# EAGLE design Analog_Temp_Ctrl (EAGLE 8.5.2)

## Sheet 1 of 2
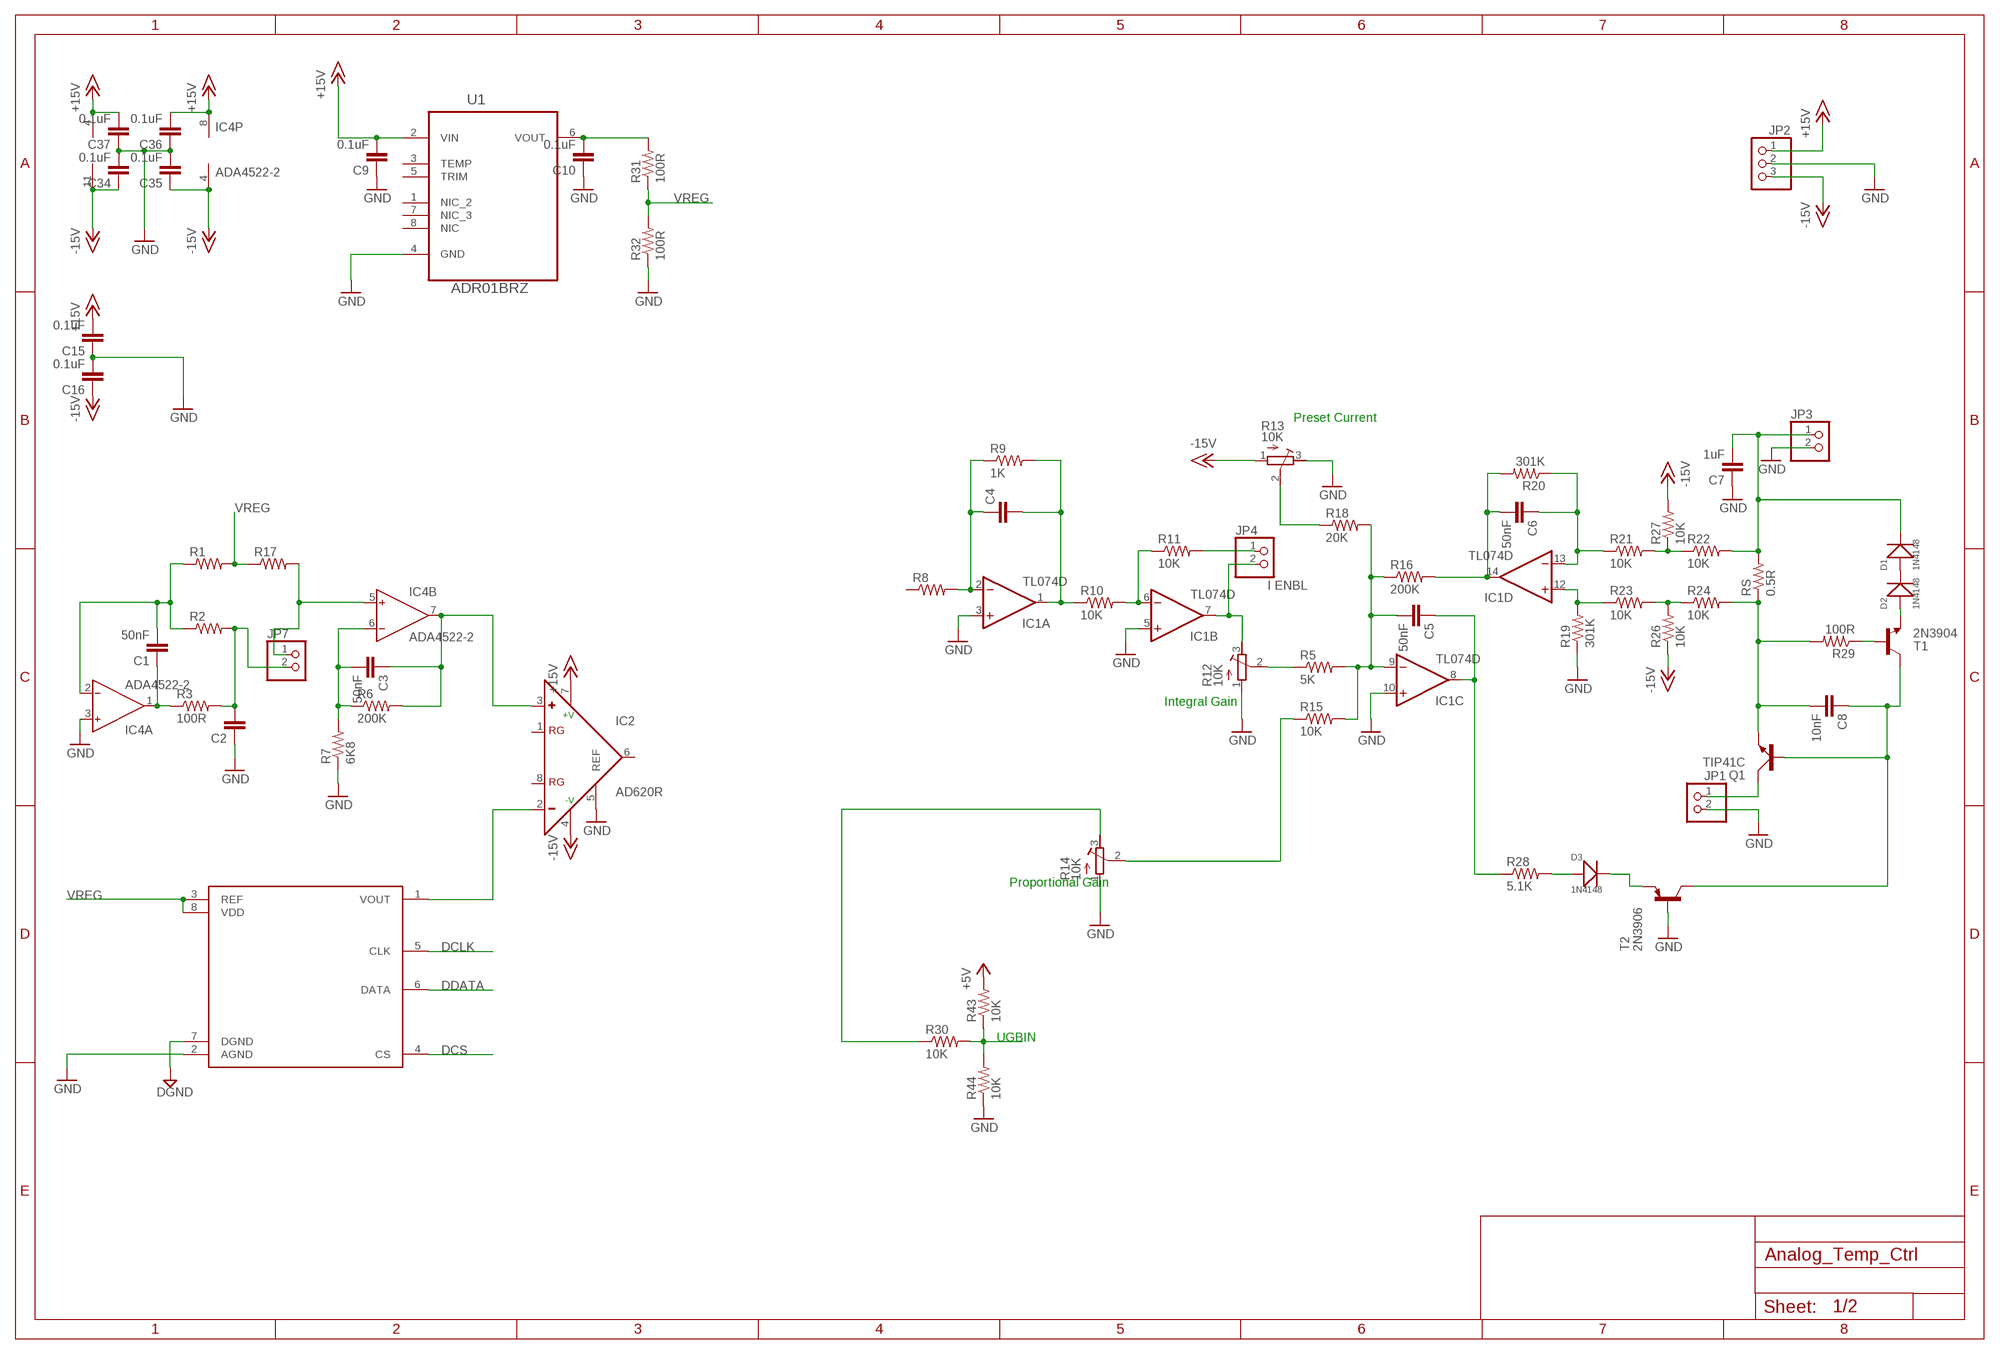
[diagram p0: schematic, sheet 1]

### Parts
C1  50nF  C-EUC0805  [C0805]
C2  C-EUC0805  [C0805]
C3  50nF  C-EUC0805  [C0805]
C4  C-EUC0805  [C0805]
C5  50nF  C-EUC0805  [C0805]
C6  50nF  C-EUC0805  [C0805]
C7  1uF  C-EUC0805  [C0805]
C8  10nF  C-EUC0805  [C0805]
C9  0.1uF  C-EUC0805  [C0805]
C10  0.1uF  C-EUC0805  [C0805]
C15  0.1uF  C-EUC0805  [C0805]
C16  0.1uF  C-EUC0805  [C0805]
C34  0.1uF  C-EUC0805  [C0805]
C35  0.1uF  C-EUC0805  [C0805]
C36  0.1uF  C-EUC0805  [C0805]
C37  0.1uF  C-EUC0805  [C0805]
D1  1N4148  SMD-DIODE-SWITCH-1N4148(LL-34)  [LL-34]
D2  1N4148  SMD-DIODE-SWITCH-1N4148(LL-34)  [LL-34]
D3  1N4148  SMD-DIODE-SWITCH-1N4148(LL-34)  [LL-34]
IC1  TL074D  [SO14]
IC2  AD620R  [SO8]
IC4  ADA4522-2  AD8599R  [SO8]
JP1  PINHD-1X2/90  [1X02/90]
JP2  PINHD-1X3/90  [1X03/90]
JP3  PINHD-1X2/90  [1X02/90]
JP4  PINHD-1X2  [1X02]
JP7  PINHD-1X2  [1X02]
Q1  TIP41C  [TO220AV]
R1  R-US_R0805  [R0805]
R2  R-US_R0805  [R0805]
R3  100R  R-US_R0805  [R0805]
R5  5K  R-US_R0805  [R0805]
R6  200K  R-US_R0805  [R0805]
R7  6K8  R-US_R0805  [R0805]
R8  R-US_R0805  [R0805]
R9  1K  R-US_R0805  [R0805]
R10  10K  R-US_R0805  [R0805]
R11  10K  R-US_R0805  [R0805]
R12  10K  R-TRIMM3296W  [RTRIM3296W]
R13  10K  R-TRIMM3296W  [RTRIM3296W]
R14  10K  R-TRIMM3296W  [RTRIM3296W]
R15  10K  R-US_R0805  [R0805]
R16  200K  R-US_R0805  [R0805]
R17  R-US_R0805  [R0805]
R18  20K  R-US_R0805  [R0805]
R19  301K  R-US_R0805  [R0805]
R20  301K  R-US_R0805  [R0805]
R21  10K  R-US_R0805  [R0805]
R22  10K  R-US_R0805  [R0805]
R23  10K  R-US_R0805  [R0805]
R24  10K  R-US_R0805  [R0805]
R26  10K  R-US_R0805  [R0805]
R27  10K  R-US_R0805  [R0805]
R28  5.1K  R-US_R0805  [R0805]
R29  100R  R-US_R0805  [R0805]
R30  10K  R-US_R0805  [R0805]
R31  100R  R-US_R0805  [R0805]
R32  100R  R-US_R0805  [R0805]
R43  10K  R-US_R0805  [R0805]
R44  10K  R-US_R0805  [R0805]
RS  0.5R  R-US_R2512  [R2512]
T1  2N3904  MMBT3904LT1-NPN-SOT23-BEC  [SOT23-BEC]
T2  2N3906  MMBT3906LT1-PNP-SOT23-BEC  [SOT23-BEC]
U1  ADR01BRZ  [SOIC127P600X175-8N]
U3  AD5541  [SOIC-8]

### Nets
+5V: R43.2 ; also sheet 2
+15V: C9.2 C15.2 C36.2 C37.2 IC1.4(P:V+) IC2.7(+V) IC4.8(P:V+) JP2.1 U1.2(VIN) ; also sheet 2
-15V: C16.1 C34.1 C35.1 IC1.11(P:V-) IC2.4(-V) IC4.4(P:V-) JP2.3 R13.1(A) R26.1 R27.2
DCLK: U3.5(CLK) ; also sheet 2
DCS: U3.4(CS) ; also sheet 2
DDATA: U3.6(DATA) ; also sheet 2
DGND: U3.7(DGND) ; also sheet 2
GND: C2.1 C7.1 C9.1 C10.1 C15.1 C16.2 C34.2 C35.2 C36.1 C37.1 IC1.3(A:+IN) IC1.5(B:+IN) IC1.10(C:+IN) IC2.5(REF) IC4.3(A:IN+) JP1.2 JP2.2 JP3.2 R7.1 R12.1(A) R13.3(E) R14.1(A) R19.1 R32.1 R44.1 T2.B U1.4(GND) U3.2(AGND) ; also sheet 2
N$1: C1.2 IC4.2(A:IN-) R1.1 R2.1
N$2: JP4.1 R11.2
N$3: R5.1 R12.2(S)
N$4: C1.1 IC4.1(A:OUT) R3.1
N$5: C4.1 IC1.2(A:-IN) R8.2 R9.1
N$6: C2.2 JP7.2 R2.2 R3.2
N$7: C3.1 IC2.3(+) IC4.7(B:OUT) R6.2
N$8: R14.2(S) R15.1
N$9: C3.2 IC4.6(B:IN-) R6.1 R7.2
N$10: R14.3(E) R30.1
N$11: C6.2 IC1.14(D:OUT) R16.2 R20.2
N$12: R13.2(S) R18.1
N$13: C5.2 IC1.9(C:-IN) R5.2 R15.2 R16.1 R18.2
N$14: C4.2 IC1.1(A:OUT) R9.2 R10.1
N$15: C5.1 IC1.8(C:OUT) R28.1
N$16: IC1.12(D:+IN) R19.2 R23.1
N$17: R21.2 R22.1 R27.1
N$19: C6.1 IC1.13(D:-IN) R20.1 R21.1
N$20: IC1.7(B:OUT) JP4.2 R12.3(E)
N$21: R23.2 R24.1 R26.2
N$22: C7.2 D1.C(-) JP3.1 R22.2 RS.2
N$23: C8.2 Q1.E R24.2 R29.2 RS.1
N$24: C10.2 R31.2 U1.6(VOUT)
N$25: D1.A(+) D2.C(-)
N$26: D3.A(+) R28.2
N$27: D3.C(-) T2.E
N$28: D2.A(+) T1.E
N$29: R29.1 T1.B
N$31: C8.1 Q1.B T1.C T2.C
N$34: JP1.1 Q1.C
N$35: IC1.6(B:-IN) R10.2 R11.1
N$36: IC2.2(-) U3.1(VOUT)
RW: IC4.5(B:IN+) JP7.1 R17.2
UGBIN: R30.2 R43.1 R44.2 ; also sheet 2
VREG: R1.2 R17.1 R31.1 R32.2 U3.3(REF) U3.8(VDD)
Unconnected: IC2.1(RG) IC2.6(OUT) IC2.8(RG) R8.1 U1.1(NIC_2) U1.3(TEMP) U1.5(TRIM) U1.7(NIC_3) U1.8(NIC)

### Notes on the sheet
- Preset Current
- I ENBL
- Integral Gain
- Proportional Gain
- UGBIN

## Sheet 2 of 2
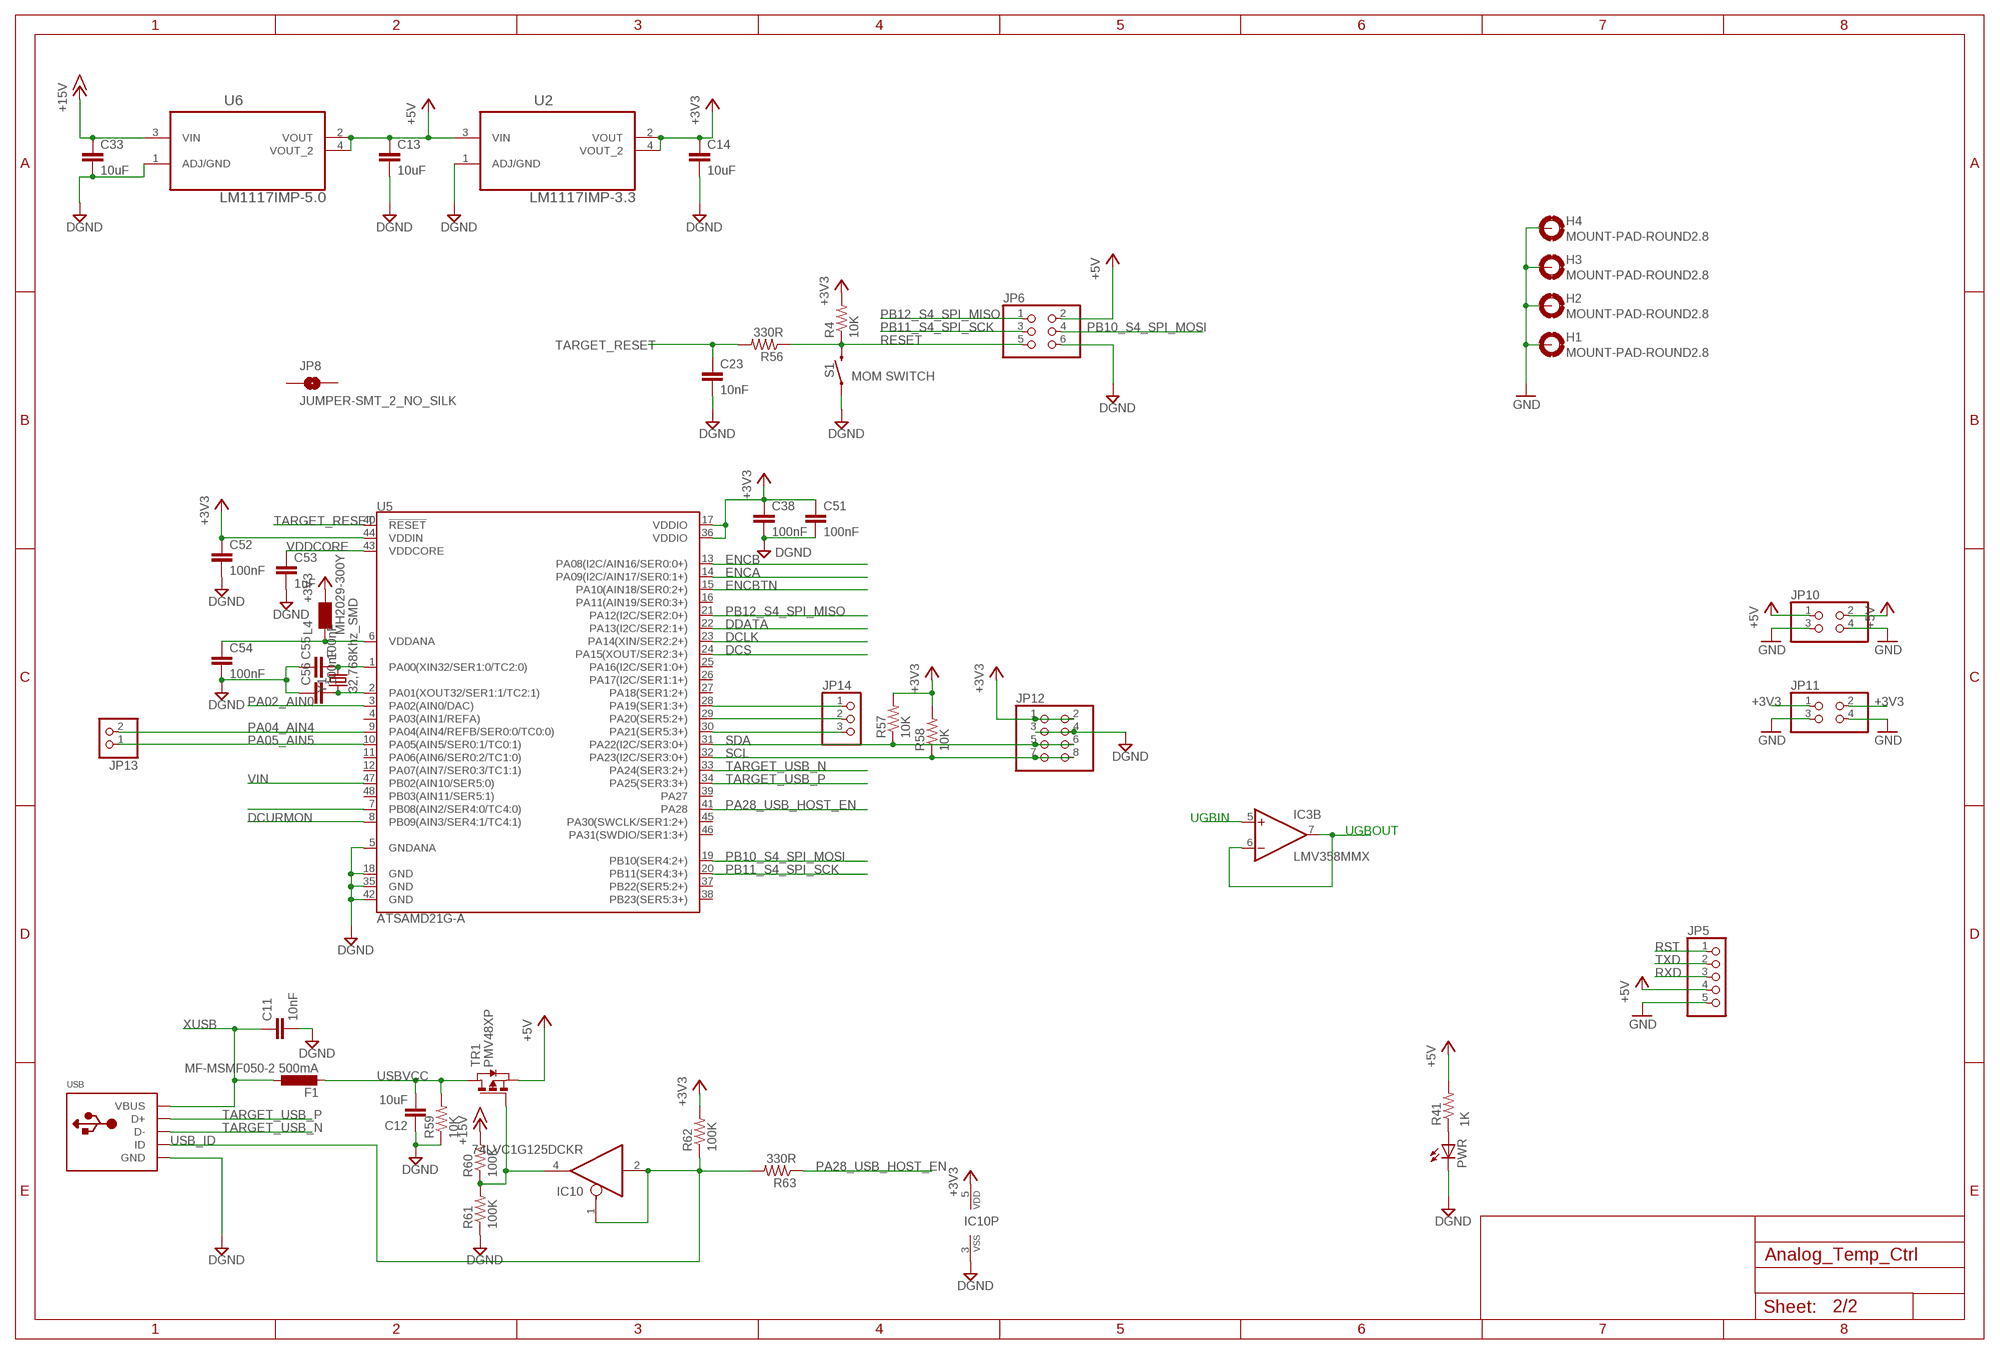
[diagram p1: schematic, sheet 2]

### Parts
C11  10nF  C-EUC0805  [C0805]
C12  10uF  C-EUC0805  [C0805]
C13  10uF  C-EUC0805  [C0805]
C14  10uF  C-EUC0805  [C0805]
C23  10nF  C-EUC0805  [C0805]
C33  10uF  C-EUC0805  [C0805]
C38  100nF  C-EUC0805  [C0805]
C51  100nF  C-EUC0805  [C0805]
C52  100nF  C-EUC0805  [C0805]
C53  1uF  C-EUC0805  [C0805]
C54  100nF  C-EUC0805  [C0805]
C55  100nF  C-EUC0805  [C0805]
C56  100nF  C-EUC0805  [C0805]
F1  MF-MSMF050-2 500mA  PROTEZIONE_0002_MF-MSMF050-2  [PROTEZIONE_L1812]
H1  MOUNT-PAD-ROUND2.8  [2,8-PAD]
H2  MOUNT-PAD-ROUND2.8  [2,8-PAD]
H3  MOUNT-PAD-ROUND2.8  [2,8-PAD]
H4  MOUNT-PAD-ROUND2.8  [2,8-PAD]
IC3  LMV358MMX  [MSOP08]
IC10  74LVC1G125DCKR  INTEGRATEDCIRCUITS_0040_SN74LVC1G125DCKR  [INTEGRATEDCIRCUITS_SC70-5]
JP5  PINHD-1X5  [1X05]
JP6  PINHD-2X3  [2X03]
JP8  JUMPER-SMT_2_NO_SILK  [SMT-JUMPER_2_NO_SILK]
JP10  PINHD-2X2  [2X02]
JP11  PINHD-2X2  [2X02]
JP12  PINHD-2X4  [2X04]
JP13  PINHD-1X2  [1X02]
JP14  PINHD-1X3  [1X03]
L4  MH2029-300Y  PROTEZIONE_0001_BLM21PG300SN1D_/_MH2029-300Y  [PROTEZIONE_0805]
PWR  LEDCHIPLED_0805  [CHIPLED_0805]
R4  10K  R-US_R0805  [R0805]
R41  1K  R-US_R0805  [R0805]
R56  330R  R-US_R0805  [R0805]
R57  10K  R-US_R0805  [R0805]
R58  10K  R-US_R0805  [R0805]
R59  10K  R-US_R0805  [R0805]
R60  100K  R-US_R0805  [R0805]
R61  100K  R-US_R0805  [R0805]
R62  100K  R-US_R0805  [R0805]
R63  330R  R-US_R0805  [R0805]
S1  MOM SWITCH  MOMENTARY-SWITCH-SPST-SMD-5.2MM  [TACTILE_SWITCH_SMD_5.2MM]
TR1  PMV48XP  TRANSISTORS_0297_PMV48XP  [TRANSISTORS_SOT-23]
U2  LM1117IMP-3.3  [SOT230P696X180-4N]
U5  ATSAMD21G-A  [TQFP-48]
U6  LM1117IMP-5.0  [SOT230P696X180-4N]
USB  USBMINIB  [USB-MINIB]
Y1  32,768Khz_SMD  CRISTALLI_0213_ABS07-32.768KHZ-T  [CRISTALLI_RESONATOR_EPSON_FC_145]

### Nets
3V3: JP11.1 JP11.2
+3V3: C14.1 C38.1 C51.1 C52.1 IC10.5(VDD) JP12.1 JP12.2 L4.2 R4.2 R57.2 R58.2 R62.2 U2.2(VOUT) U2.4(VOUT_2) U5.17(VDDIO) U5.36(VDDIO) U5.44(VDDIN)
+5V: C13.1 JP5.4 JP6.2 JP10.1 JP10.2 R41.2 TR1.2(S) U2.3(VIN) U6.2(VOUT) U6.4(VOUT_2) ; also sheet 1
+15V: C33.1 R60.2 U6.3(VIN) ; also sheet 1
DCLK: U5.23(PA14(XIN/SER2:2+)) ; also sheet 1
DCS: U5.24(PA15(XOUT/SER2:3+)) ; also sheet 1
DCURMON: U5.8(PB09(AIN3/SER4:1/TC4:1))
DDATA: U5.22(PA13(I2C/SER2:1+)) ; also sheet 1
DGND: C11.2 C12.1 C13.2 C14.2 C23.2 C33.2 C38.2 C51.2 C52.2 C53.2 C54.2 C55.1 C56.1 IC10.3(VSS) JP6.6 JP12.3 JP12.4 PWR.C R59.1 R61.1 S1.1 U2.1(ADJ/GND) U5.5(GNDANA) U5.18(GND) U5.35(GND) U5.42(GND) U6.1(ADJ/GND) USB.GND ; also sheet 1
ENCA: U5.14(PA09(I2C/AIN17/SER0:1+))
ENCB: U5.13(PA08(I2C/AIN16/SER0:0+))
ENCBTN: U5.15(PA10(AIN18/SER0:2+))
GND: H1.B2,8(MOUNT) H2.B2,8(MOUNT) H3.B2,8(MOUNT) H4.B2,8(MOUNT) JP5.5 JP10.3 JP10.4 JP11.3 JP11.4 ; also sheet 1
N$18: C54.1 L4.1 U5.6(VDDANA)
N$46: IC10.4(O) R60.1 R61.2 TR1.3(G)
N$49: PWR.A R41.1
N$52: C55.2 U5.1(PA00(XIN32/SER1:0/TC2:0)) Y1.P$2
N$59: C56.2 U5.2(PA01(XOUT32/SER1:1/TC2:1)) Y1.P$1
N$60: U5.7(PB08(AIN2/SER4:0/TC4:0))
N$61: JP14.3 U5.30(PA21(SER5:3+))
N$62: JP14.2 U5.29(PA20(SER5:2+))
N$63: JP14.1 U5.28(PA19(SER1:3+))
PA02_AIN0: U5.3(PA02(AIN0/DAC))
PA04_AIN4: JP13.2 U5.9(PA04(AIN4/REFB/SER0:0/TC0:0))
PA05_AIN5: JP13.1 U5.10(PA05(AIN5/SER0:1/TC0:1))
PA28_USB_HOST_EN: R63.1 U5.41(PA28)
PB10_S4_SPI_MOSI: JP6.4 U5.19(PB10(SER4:2+))
PB11_S4_SPI_SCK: JP6.3 U5.20(PB11(SER4:3+))
PB12_S4_SPI_MISO: JP6.1 U5.21(PA12(I2C/SER2:0+))
RESET: JP6.5 R4.1 R56.1 S1.3
RST: JP5.1
RXD: JP5.3
SCL: JP12.7 JP12.8 R58.1 U5.32(PA23(I2C/SER3:0+))
SDA: JP12.5 JP12.6 R57.1 U5.31(PA22(I2C/SER3:0+))
TARGET_RESET: C23.1 R56.2 U5.40(!RESET!)
TARGET_USB_N: U5.33(PA24(SER3:2+)) USB.D-
TARGET_USB_P: U5.34(PA25(SER3:3+)) USB.D+
TXD: JP5.2
UGBIN: IC3.5(B:+IN) ; also sheet 1
UGBOUT: IC3.6(B:-IN) IC3.7(B:OUT)
USB_ID: IC10.1(OE) IC10.2(I) R62.1 R63.2 USB.ID
USBVCC: C12.2 F1.2 R59.2 TR1.1(D)
VDDCORE: C53.1 U5.43(VDDCORE)
VIN: U5.47(PB02(AIN10/SER5:0))
XUSB: C11.1 F1.1 USB.VBUS
Unconnected: IC3.1(A:OUT) IC3.2(A:-IN) IC3.3(A:+IN) JP8.1 JP8.2 U5.4(PA03(AIN1/REFA)) U5.11(PA06(AIN6/SER0:2/TC1:0)) U5.12(PA07(AIN7/SER0:3/TC1:1)) U5.16(PA11(AIN19/SER0:3+)) U5.25(PA16(I2C/SER1:0+)) U5.26(PA17(I2C/SER1:1+)) U5.27(PA18(SER1:2+)) U5.37(PB22(SER5:2+)) U5.38(PB23(SER5:3+)) U5.39(PA27) U5.45(PA30(SWCLK/SER1:2+)) U5.46(PA31(SWDIO/SER1:3+)) U5.48(PB03(AIN11/SER5:1))

### Notes on the sheet
- +3V3 | +3V3
- UGBIN
- UGBOUT
- RST
- TXD
- RXD

## Power pins joined to a net without a drawn wire
V+: IC3.8(P:V+)
V-: IC3.4(P:V-)

## Library data of the parts
C1-C16 C23 C33-C38 C51-C56 = rcl:C-EU: CAPACITOR, European symbol; SPICEPREFIX: C
D1-D3 = Seeed-Diode:SMD-DIODE-SWITCH-1N4148(LL-34): 304040016; MPN: 1N4148
F1 = Arduino-M0-V1:PROTEZIONE_0002_MF-MSMF050-2: 500 mA Multifuse ? Polyfuse; MONTHLY_USAGE: _____; PART_NUMBER: MF-MSMF050-2; PRICE: _____; SUPPLIER: _____; TYPE: Protezione
H1-H4 = holes:MOUNT-PAD-ROUND: MOUNTING PAD, round
IC1 = linear:TL074: OP AMP
IC2 = analog-devices:AD620: Low Cost, Low Power, Instrumentation Amplifier Source: http://www.analog.com/UploadedFiles/Data_Sheets/37793330023930AD620_e.pdf; MPN: AD620AR; OC_FARNELL: 1464424; OC_NEWARK: 05F7109
IC3 = linear:LMV358?*: Dual General Purpose, Low Voltage, Rail-to-Rail Output Operational Amplifiers Source: http://www.national.com/mpf/LM/LMV321.html http://www.national.com/dt/lmv_qual.pdf
IC4 = analog-devices:AD8599: Single and Dual, Ultralow Distortion, Ultralow Noise Op Amps Source: http://www.analog.com/static/imported-files/data_sheets/AD8597_8599.pdf; MPN: AD8599ARZ; OC_FARNELL: 1438872; OC_NEWARK: 34M5072
IC10 = Arduino-M0-V1:INTEGRATEDCIRCUITS_0040_SN74LVC1G125DCKR: Single bus buffer with 3-state output; CASE: SC70; MONTHLY_USAGE: _____; PART_NUMBER: SN74LVC1G125DCKR; PRICE: _____; SUPPLIER: _____; TYPE: Circuito_Integrato
JP1 JP3 JP4 JP7 JP13 = pinhead:PINHD-1X2: PIN HEADER
JP2 JP14 = pinhead:PINHD-1X3: PIN HEADER
JP5 = pinhead:PINHD-1X5: PIN HEADER
JP6 = pinhead:PINHD-2X3: PIN HEADER
JP8 = SparkFun-Jumpers:JUMPER-SMT_2_NO: Normally open jumper This jumper has two pads in close proximity to each other. Apply solder to close the connection. Round pads are easier to solder for beginners, but are a lot larger. SparkFun Product that uses the round pads: SparkFun EL Sequencer <https://www.sparkfun.com/products/12781>
JP10 JP11 = pinhead:PINHD-2X2: PIN HEADER
JP12 = pinhead:PINHD-2X4: PIN HEADER
L4 = Arduino-M0-V1:PROTEZIONE_0001_BLM21PG300SN1D_/_MH2029-300Y: BLM21; MONTHLY_USAGE: _____; PART_NUMBER: BLM21PG300SN1D_/_MH2029-300Y; PRICE: _____; SUPPLIER: _____; TYPE: Protezione
PWR = led:LED: LED OSRAM: - CHIPLED LG R971, LG N971, LY N971, LG Q971, LY Q971, LO R971, LY R971 LH N974, LH R974 LS Q976, LO Q976, LY Q976 LO Q996 - Hyper CHIPLED LW Q18S LB Q993, LB Q99A, LB R99A - SideLED LS A670, LO A670, LY A670, LG A670, LP A670 LB A673, LV A673, LT A673, LW A673 LH A674 LY A675 LS A676, LA A676, LO A676, LY A676, LW A676 LS A679, LY A679, LG A679 - Hyper Micro SIDELED® LS Y876, LA Y876, LO Y876, LY Y876 LT Y87S - SmartLED LW L88C, LW L88S LB L89C, LB L89S, LG L890 LS L89K, LO L89K, LY L89K LS L896, LA L896, LO L896, LY L896 - TOPLED LS T670, LO T670, LY T670, LG T670, LP T670 LSG T670, LSP T670, LSY T670, LOP T670, LYG T670 LG T671, LOG T671, LSG T671 LB T673, LV T673, LT T673, LW T673 LH T674 LS T676, LA T676, LO T676, LY T676, LB T676, LH T676, LSB T676, LW T676 LB T67C, LV T67C, LT T67C, LS T67K, LO T67K, LY T67K, LW E67C LS E67B, LA E67B, LO E67B, LY E67B, LB E67C, LV E67C, LT E67C LW T67C LS T679, LY T679, LG T679 LS T770, LO T770, LY T770, LG T770, LP T770 LB T773, LV T773, LT T773, LW T773 LH T774 LS E675, LA E675, LY E675, LS T675 LS T776, LA T776, LO T776, LY T776, LB T776 LHGB T686 LT T68C, LB T68C - Hyper Mini TOPLED® LB M676 - Mini TOPLED Santana® LG M470 LS M47K, LO M47K, LY M47K Source: http://www.osram.convergy.de LUXEON: - LUMILED® LXK2-PW12-R00, LXK2-PW12-S00, LXK2-PW14-U00, LXK2-PW14-V00 LXK2-PM12-R00, LXK2-PM12-S00, LXK2-PM14-U00 LXK2-PE12-Q00, LXK2-PE12-R00, LXK2-PE12-S00, LXK2-PE14-T00, LXK2-PE14-U00 LXK2-PB12-K00, LXK2-PB12-L00, LXK2-PB12-M00, LXK2-PB14-N00, LXK2-PB14-P00, LXK2-PB14-Q00 LXK2-PR12-L00, LXK2-PR12-M00, LXK2-PR14-Q00, LXK2-PR14-R00 LXK2-PD12-Q00, LXK2-PD12-R00, LXK2-PD12-S00 LXK2-PH12-R00, LXK2-PH12-S00 LXK2-PL12-P00, LXK2-PL12-Q00, LXK2-PL12-R00 Source: www.luxeon.com KINGBRIGHT: KA-3528ASYC Source: www.kingbright.com
Q1 = transistor-power:TIP41C: NPN TRANSISTOR
R1-R11 R15-R24 R26-R32 R41 R43 R44 R56-R63 = rcl:R-US_: RESISTOR, American symbol; SPICEPREFIX: R
R12-R14 = rcl:R-TRIMM: Trimm resistor
RS = adafruit:R-US_: RESISTOR, American symbol
S1 = SparkFun-Switches:MOMENTARY-SWITCH-SPST: Momentary Switch (Pushbutton) - SPST Normally-open (NO) SPST momentary switches (buttons, pushbuttons). Variants PTH-12MM - 12mm square, through-hole Momentary Pushbutton Switch - 12mm Square <https://www.sparkfun.com/products/9190> (COM-09190) PTH-6.0MM, PTH-6.0MM-KIT - 6.0mm square, through-hole Mini Pushbutton Switch <https://www.sparkfun.com/products/97> (COM-00097) KIT package intended for soldering kit's - only one side of pads' copper is exposed. PTH-RIGHT-ANGLE-KIT - Right-angle, through-hole Right Angle Tactile Button <https://www.sparkfun.com/products/10791> - Used on SparkFun BigTime Watch Kit <https://www.sparkfun.com/products/11734> SMD-12MM - 12mm square, surface-mount Tactile Button - SMD (12mm) <https://www.sparkfun.com/products/12993> (COM-12993) Used on SparkFun PicoBoard <https://www.sparkfun.com/products/11888> SMD-4.5MM - 4.5mm Square Trackball Switch Used on SparkFun Blackberry Trackballer Breakout <https://www.sparkfun.com/products/13169> SMD-4.6MMX2.8MM - 4.60mm x 2.80mm, surface mount Used on SparkFun SAMD21 Mini Breakout <https://www.sparkfun.com/products/13664> SMD-5.2MM, SMD-5.2-REDUNDANT - 5.2mm square, surface-mount Mini Pushbutton Switch - SMD <https://www.sparkfun.com/products/8720> (COM-08720) Used on Arduino Pro Mini <https://www.sparkfun.com/products/11114> REDUNDANT package connects both switch circuits together SMD-6.0X3.5MM - 6.0 x 3.5mm, surface mount Momentary Reset Switch SMD <https://www.sparkfun.com/products/8229> (COM-08229) SMD-6.2MM-TALL - 6.2mm square, surface mount Tactile Button - SMD (6mm) <https://www.sparkfun.com/products/12992> Used on SparkFun Digital Sandbox <https://www.sparkfun.com/products/12651> SMD-RIGHT-ANGLE - Right-angle, surface mount Used on SparkFun Block for Intel® Edison - Arduino <https://www.sparkfun.com/products/13036>; PROD_ID: SWCH-08247; SF_SKU: COM-08720
T1 = transistor:*-NPN-: NPN Transistror BF959 corrected 2008.03.06
T2 = transistor:*-PNP-: PNP Transistror
TR1 = Arduino-M0-V1:TRANSISTORS_0297_PMV48XP: 20 V, 3.5 A P-channel Trench MOSFET - PMV48XP; CASE: SOT23; MONTHLY_USAGE: _____; PART_NUMBER: PMV48XP; PRICE: _____; SUPPLIER: _____; TYPE: Transistor
U1 = Analog Devices_By_element14_Batch_1:ADR01BRZ: Ultracompact, Precision 10.0 V/5.0 V/2.5 V/3.0 V Voltage References; MPN: ADR01BRZ; OC_FARNELL: -; OC_NEWARK: 59K2657; PACKAGE: SOIC-8; SUPPLIER: Analog Devices
U2 = NSC_By_element14_Batch_1.1:LM1117IMP-3.3: IC REG LDO 800MA 3.3V; MPN: LM1117IMP-3.3; OC_FARNELL: 1469051; OC_NEWARK: 41K3450; PACKAGE: SOT-223; SUPPLIER: National Semiconductor
U3 = misc-ics:AD5541
U5 = SparkFun-IC-Microcontroller:ATSAMD21G: Atmel SAMD21G SMART ARM-Based Microcontroller The Atmel ® | SMART ™ SAM D21 is a series of low-power microcontrollers using the 32-bit ARM ® Cortex ® -M0+ processor, and ranging from 32- to 64-pins with up to 256KB Flash and 32KB of SRAM. The SAM D21 devices operate at a maximum frequency of 48MHz and reach 2.46 CoreMark/MHz. They are designed for simple and intuitive migration with identical peripheral modules, hex compatible code, identical linear address map and pin compatible migration paths between all devices in the product series. All devices include intelligent and flexible peripherals, Atmel Event System for inter-peripheral signaling, and support for capacitive touch button, slider and wheel user interfaces. Datasheet <https://cdn.sparkfun.com/datasheets/Dev/Arduino/Boards/Atmel-42181-SAM-D21_Datasheet.pdf> SparkFun Products SparkFun SAMD21 Mini Breakout <https://www.sparkfun.com/products/13664> (DEV-13664) SparkFun SAMD21 Dev Breakout <https://www.sparkfun.com/products/13672> (DEV-13672); PROD_ID: IC-13064
U6 = NSC_By_element14_Batch_1.1:LM1117IMP-5.0: IC REG LDO 800MA 5.0V; MPN: LM1117IMP-5.0; OC_FARNELL: -; OC_NEWARK: 41K3451; PACKAGE: SOT-223; SUPPLIER: National Semiconductor
USB = adafruit:USB: USB Connectors USBMINIB - Surface Mount Female Mini-B USB Connector 4UConnector: 06564 By microbuilder.eu Thru-hole RA Female Mini-B USB Connector 4UConnector: 18732 By ladyada.net
Y1 = Arduino-M0-V1:CRISTALLI_0213_ABS07-32.768KHZ-T: 32,768KHz - SMD; MONTHLY_USAGE: _____; PART_NUMBER: ABS07-32.768KHZ-T; PRICE: _____; SUPPLIER: _____; TYPE: Cristalli

## Board
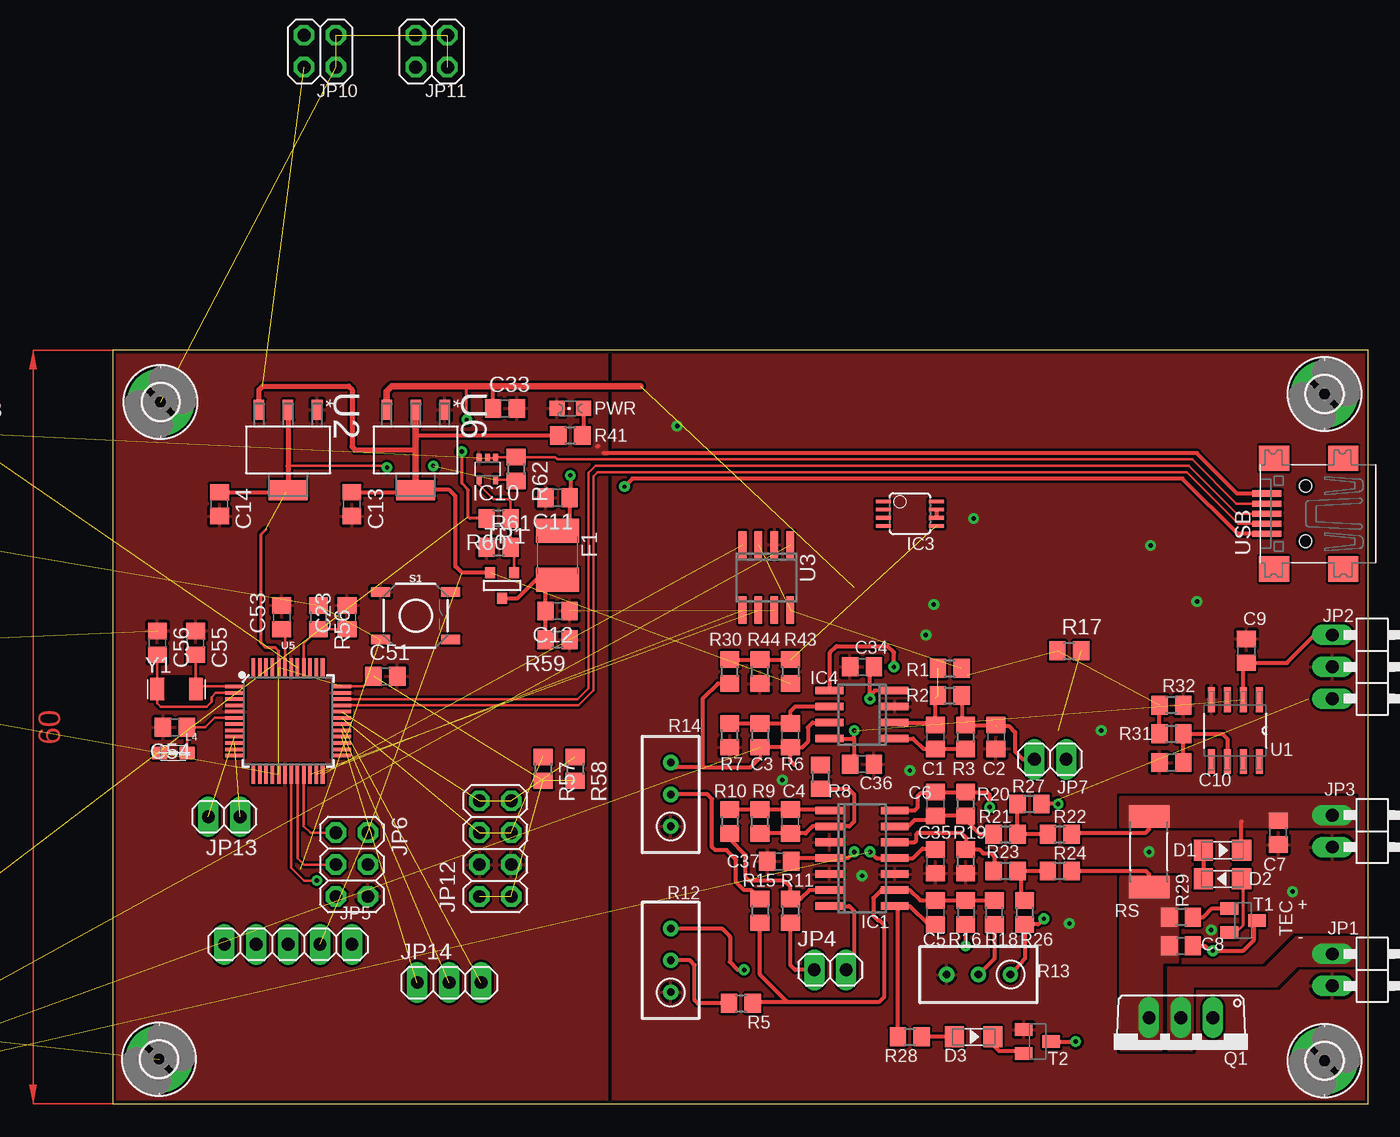
[diagram p2: board, top side]
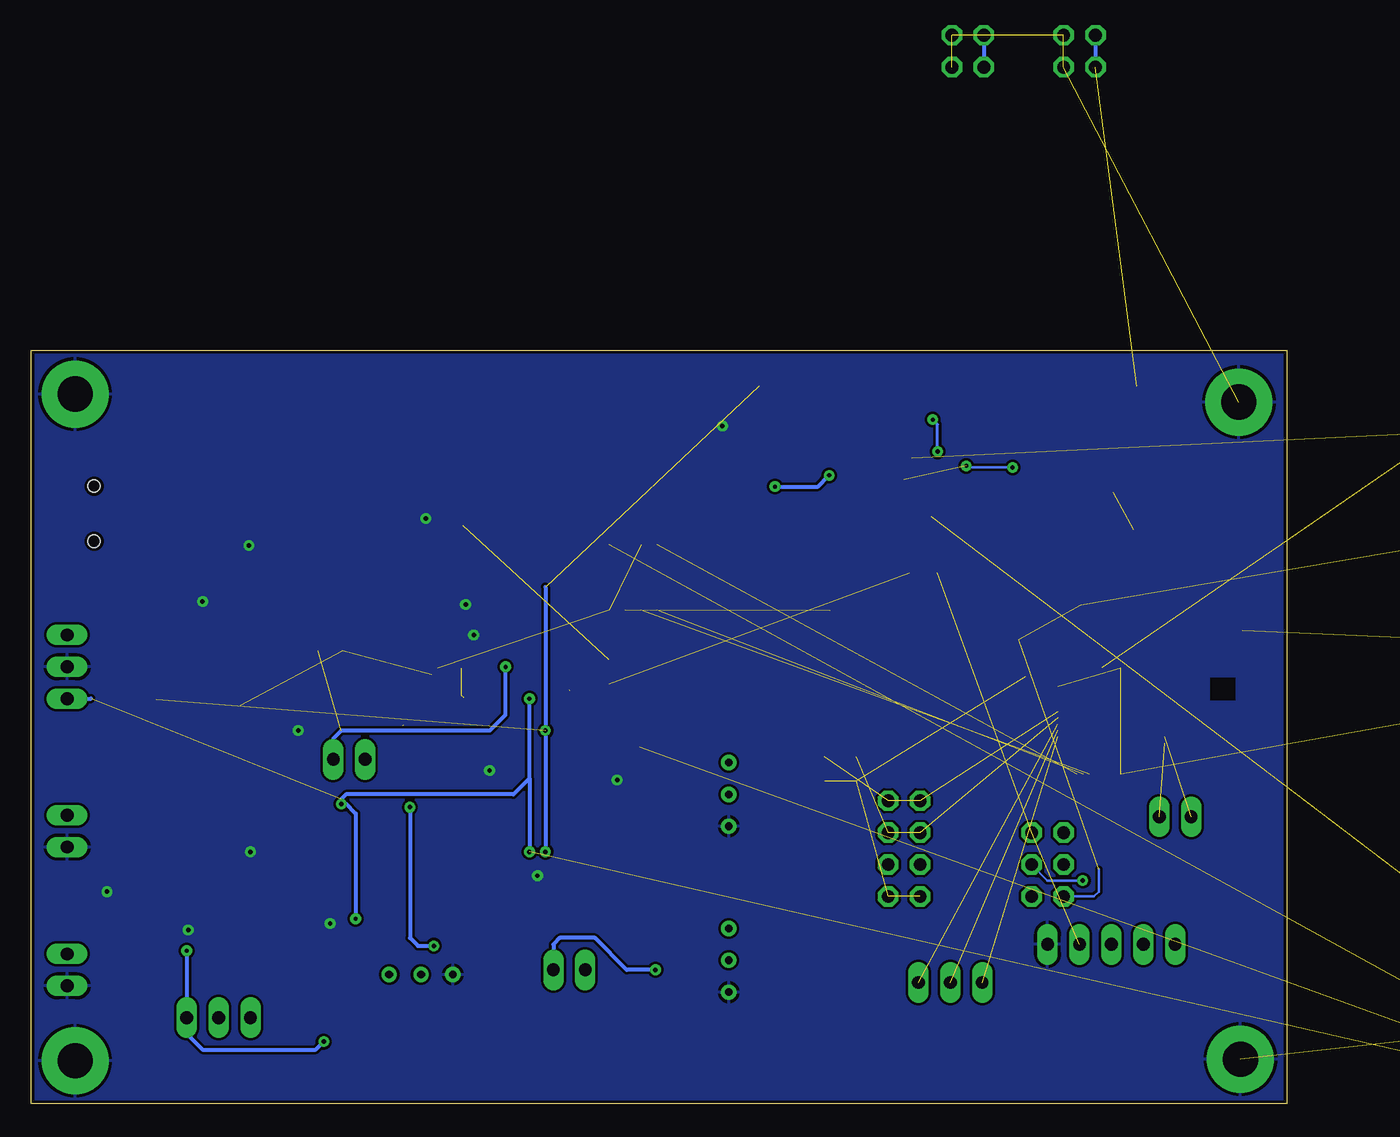
[diagram p3: board, bottom side, seen from below]

Size 100 x 60 mm. Coordinates in mm from the lower left corner, seen from the top.
Outline: 0,0 100,0 100,60 0,60 0,0
Copper layers (1*16): Top 0.035mm / dielectric 1.5mm / Bottom 0.035mm
Design rules "SparkFun": minimum track width 8mil, minimum drill 13mil, track to track 8mil, track to pad 8mil, pad to pad 8mil, via to via 8mil, smd to smd 8mil, copper to edge 10mil, drill to drill 8mil, minimum pad ring 12mil, minimum via ring 10mil, stop-mask expansion 4mil, vias tented up to drill 25mil, thermal gap 10mil

### Footprints (pad centres in the part's own frame; a part is rotated, then mirrored left to right if it is on the bottom)
C0805 = smd 1.3 x 1.5: 1 -0.95,0; 2 0.95,0
LL-34 = smd 1.524 x 1.676: A -1.524,0; C 1.524,0
PROTEZIONE_L1812 = smd 1.9 x 3.4: 1 -1.95,0; 2 1.95,0
2,8-PAD = drill 2.8 pad 5.334: B2,8 0,0
SO14 = smd 0.6 x 2.2: 1 -3.81,-2.6; 2 -2.54,-2.6; 3 -1.27,-2.6; 4 0,-2.6; 5 1.27,-2.6; 6 2.54,-2.6; 7 3.81,-2.6; 8 3.81,2.6; 9 2.54,2.6; 10 1.27,2.6; 11 0,2.6; 12 -1.27,2.6; 13 -2.54,2.6; 14 -3.81,2.6
SO8 = smd 0.6 x 2.2: 1 -1.905,-2.6; 2 -0.635,-2.6; 3 0.635,-2.6; 4 1.905,-2.6; 5 1.905,2.6; 6 0.635,2.6; 7 -0.635,2.6; 8 -1.905,2.6
MSOP08 = smd 0.3 x 1.2: 1 -0.976,-2.113; 2 -0.326,-2.113; 3 0.324,-2.113; 4 0.974,-2.113; 5 0.974,2.112; 6 0.324,2.112; 7 -0.326,2.112; 8 -0.976,2.112
INTEGRATEDCIRCUITS_SC70-5 = smd 0.4 x 0.7: 1 -0.65,-0.85; 2 0,-0.85; 3 0.65,-0.85; 4 0.65,0.85; 5 -0.65,0.85
1X02/90 = drill 1.016 long: 1 -1.27,-3.81; 2 1.27,-3.81
1X03/90 = drill 1.016 long: 1 -2.54,-3.81; 2 0,-3.81; 3 2.54,-3.81
1X02 = drill 1.016 long: 1 -1.27,0; 2 1.27,0
1X05 = drill 1.016 long: 1 -5.08,0; 2 -2.54,0; 3 0,0; 4 2.54,0; 5 5.08,0
2X03 = drill 1.016 octagon: 1 -2.54,-1.27; 2 -2.54,1.27; 3 0,-1.27; 4 0,1.27; 5 2.54,-1.27; 6 2.54,1.27
SMT-JUMPER_2_NO_SILK = smd 0.635 x 1.27: 1 -0.406,0; 2 0.406,0
2X02 = drill 1.016 octagon: 1 -1.27,-1.27; 2 -1.27,1.27; 3 1.27,-1.27; 4 1.27,1.27
2X04 = drill 1.016 octagon: 1 -3.81,-1.27; 2 -3.81,1.27; 3 -1.27,-1.27; 4 -1.27,1.27; 5 1.27,-1.27; 6 1.27,1.27; 7 3.81,-1.27; 8 3.81,1.27
1X03 = drill 1.016 long: 1 -2.54,0; 2 0,0; 3 2.54,0
PROTEZIONE_0805 = smd 1.2 x 1: 1 -1.1,0; 2 1.1,0
CHIPLED_0805 = smd 1.2 x 1.2: A 0,-1.05; C 0,1.05
TO220AV = drill 1.016 long: B -2.54,-2.54; C 0,-2.54; E 2.54,-2.54
R0805 = smd 1.3 x 1.5: 1 -0.95,0; 2 0.95,0
RTRIM3296W = drill 0.61: 1 0,-2.54; 2 0,0; 3 0,2.54
R2512 = smd 1.8 x 3.2: 1 -2.8,0; 2 2.8,0
TACTILE_SWITCH_SMD_5.2MM = smd 1.524 x 0.762: 1 -2.794,1.905; 2 2.794,1.905; 3 -2.794,-1.905; 4 2.794,-1.905
SOT23-BEC = smd 1 x 1.4: B -0.95,-1.1; C 0,1.1; E 0.95,-1.1
TRANSISTORS_SOT-23 = smd 0.787 x 0.889: 1 0.025,-1.016; 2 -0.94,1.016; 3 0.991,1.016
SOIC127P600X175-8N = smd 1.981 x 0.559: 1 -2.464,1.905; 2 -2.464,0.635; 3 -2.464,-0.635; 4 -2.464,-1.905; 5 2.464,-1.905; 6 2.464,-0.635; 7 2.464,0.635; 8 2.464,1.905
SOT230P696X180-4N = smd 1.6 x 0.838: 1 -3.2,2.311; 2 -3.2,0; 3 -3.2,-2.311 | smd 1.6 x 3.099: 4 3.2,0
SOIC-8 = smd 0.6 x 2.2: 1 -1.905,-2.6; 2 -0.635,-2.6; 3 0.635,-2.6; 4 1.905,-2.6; 5 1.905,2.6; 6 0.635,2.6; 7 -0.635,2.6; 8 -1.905,2.6
TQFP-48 = smd 1.5 x 0.28: 1 -4.25,2.75; 2 -4.25,2.25; 3 -4.25,1.75; 4 -4.25,1.25; 5 -4.25,0.75; 6 -4.25,0.25; 7 -4.25,-0.25; 8 -4.25,-0.75; 9 -4.25,-1.25; 10 -4.25,-1.75; 11 -4.25,-2.25; 12 -4.25,-2.75; 25 4.25,-2.75; 26 4.25,-2.25; 27 4.25,-1.75; 28 4.25,-1.25; 29 4.25,-0.75; 30 4.25,-0.25; 31 4.25,0.25; 32 4.25,0.75; 33 4.25,1.25; 34 4.25,1.75; 35 4.25,2.25; 36 4.25,2.75 | smd 0.28 x 1.5: 13 -2.75,-4.25; 14 -2.25,-4.25; 15 -1.75,-4.25; 16 -1.25,-4.25; 17 -0.75,-4.25; 18 -0.25,-4.25; 19 0.25,-4.25; 20 0.75,-4.25; 21 1.25,-4.25; 22 1.75,-4.25; 23 2.25,-4.25; 24 2.75,-4.25; 37 2.75,4.25; 38 2.25,4.25; 39 1.75,4.25; 40 1.25,4.25; 41 0.75,4.25; 42 0.25,4.25; 43 -0.25,4.25; 44 -0.75,4.25; 45 -1.25,4.25; 46 -1.75,4.25; 47 -2.25,4.25; 48 -2.75,4.25
USB-MINIB = smd 0.5 x 2.308: D+ 0,4.064; D- -0.8,4.064; GND 1.6,4.064; ID 0.8,4.064; VBUS -1.6,4.064 | smd 2 x 2.4: GND1 -4.4,-2; GND2 -4.4,3.5; GND3 4.4,3.5; GND4 4.4,-2 | hole 1: -2.2,1; 2.2,1
CRISTALLI_RESONATOR_EPSON_FC_145 = smd 1.1 x 1.8: P$1 -1.55,0; P$2 1.55,0

### Placement (x,y rotation side)
C1  65.53,29.21 90 top
C2  70.36,29.21 90 top
C3  53.98,29.34 90 top
C4  53.98,22.48 90 top
C5  65.53,15.24 90 top
C6  65.53,23.88 90 top
C7  92.84,21.59 90 top
C8  85.09,12.57 180 top
C9  90.3,36.07 270 top
C10  84.33,27.18 0 top
C11  35.43,48.26 180 top
C12  35.43,39.24 180 top
C13  19.05,47.75 270 top
C14  8.51,47.75 270 top
C15  -25.4,-3.81 0 top  (outside the outline)
C16  -25.4,-10.16 0 top  (outside the outline)
C23  18.67,38.73 90 top
C33  31.24,55.37 0 top
C34  59.69,34.8 180 top
C35  65.53,19.3 270 top
C36  59.69,27.05 180 top
C37  53.09,19.3 0 top
C38  -16.51,36.83 0 top  (outside the outline)
C51  21.72,34.04 0 top
C52  -16.51,31.75 0 top  (outside the outline)
C53  13.46,38.73 90 top
C54  4.95,29.97 180 top
C55  6.6,36.7 270 top
C56  3.56,36.7 270 top
D1  88.39,20.19 0 top
D2  88.39,17.91 180 top
D3  68.58,5.33 0 top
F1  35.43,43.69 270 top
H1  96.52,3.43 0 top
H2  3.68,3.56 0 top
H3  96.52,56.52 0 top
H4  3.81,55.88 0 top
IC1  59.69,19.56 270 top
IC2  -24.13,3.81 0 top  (outside the outline)
IC3  63.5,46.99 270 top
IC4  59.69,30.99 90 top
IC10  29.84,50.55 180 top
JP1  100.97,10.67 270 top
JP2  100.97,34.8 270 top
JP3  100.97,21.72 270 top
JP4  57.15,10.67 0 top
JP5  13.97,12.7 0 top
JP6  19.05,19.05 270 top
JP7  74.68,27.43 180 top
JP8  -38.1,-20.32 0 top  (outside the outline)
JP10  16.51,83.82 0 top  (outside the outline)
JP11  25.4,83.82 0 top  (outside the outline)
JP12  30.48,20.32 90 top
JP13  8.89,22.86 180 top
JP14  26.8,9.65 0 top
L4  4.83,27.94 180 top
PWR  36.45,55.37 90 top
Q1  85.09,4.32 180 top
R1  66.67,34.67 0 top
R2  66.67,32.51 0 top
R3  67.94,29.21 90 top
R4  -33.02,48.26 0 top  (outside the outline)
R5  50.04,8 0 top
R6  51.56,29.34 270 top
R7  49.15,29.34 90 top
R8  56.39,26.04 270 top
R9  51.56,22.48 90 top
R10  49.15,22.48 270 top
R11  53.98,15.37 270 top
R12  44.45,11.43 0 top
R13  68.96,10.29 90 top
R14  44.45,24.64 0 top
R15  51.56,15.37 270 top
R16  67.94,15.24 270 top
R17  76.2,36.07 0 top
R18  70.23,15.24 90 top
R19  67.94,19.3 90 top
R20  67.94,23.88 90 top
R21  71.12,21.46 0 top
R22  75.44,21.46 0 top
R23  71.12,18.54 0 top
R24  75.44,18.54 0 top
R26  72.64,15.24 90 top
R27  73.03,23.88 0 top
R28  63.5,5.33 0 top
R29  85.09,14.86 180 top
R30  49.15,34.42 90 top
R31  84.33,29.46 0 top
R32  84.33,31.75 180 top
R41  36.45,53.21 180 top
R43  53.98,34.42 270 top
R44  51.56,34.42 90 top
R56  16.38,38.73 270 top
R57  34.29,26.67 270 top
R58  36.83,26.67 270 top
R59  35.43,36.96 180 top
R60  30.73,46.61 180 top
R61  30.73,44.32 0 top
R62  32.13,50.55 270 top
R63  -11.43,53.34 0 top  (outside the outline)
RS  82.55,20.07 90 top
S1  24.13,38.86 0 top
T1  90.04,14.61 270 top
T2  73.66,4.95 270 top
TR1  30.99,41.27 0 top
U1  89.41,29.72 270 top
U2  13.97,52.07 270 top
U3  52.07,41.91 180 top
U5  13.97,30.48 0 top
U6  24.13,52.07 270 top
USB  96.01,46.99 90 top
Y1  5.08,33.02 0 top

### Tracks (layer width: path | path; a pad name or v marks a point on that pad's centre or on a via)
3V3
  Bottom 0.305: JP11.2 JP11.1
+3V3  (via drill 0.33)  (12 unrouted)
  Top 0.203: IC10.5 32.03,49.7 R62.2 | U5.36 19.96,33.23 C51.1 | v21.84,50.67 21.72,50.8 13.97,50.8
  Top 0.254: U5.44 13.22,36.06 12.95,36.32 12.19,36.32 11.81,36.7 11.81,45.34 12.19,45.72
  Top 0.305: C14.1 13.8,48.7 U2.4
  Top 0.406: U2.2 13.97,50.8 U2.4
  Bottom 0.203: v21.84,50.67 25.4,50.67 v25.53,50.8
+5V  (4 unrouted)
  Top 0.305: C13.1 23.96,48.7 U6.4 24.16,48.9 26.8,48.9 27.3,48.39 27.3,42.8 27.81,42.29 TR1.2 | R41.2 24.13,53.21
  Top 0.406: U2.3 11.66,56.87 11.94,57.15 18.8,57.15 19.05,56.9 19.05,52.32 19.3,52.07 24.13,52.07
  Top 0.508: U6.2 24.13,53.21 24.13,52.07 U6.4
  Bottom 0.305: JP10.2 JP10.1
+15V  (via drill 0.33, 0.35)  (4 unrouted)
  Top 0.254: R60.2 28.45,46.61 28.32,46.74 28.32,48.9 27.81,49.4 v27.81,51.94 | v28.19,54.48 28.19,57.15
  Top 0.305: 59.05,29.46 v59.05,29.72 59.05,29.08 | v59.05,20.07 58.55,19.56 IC1.4 54.29,19.56 C37.2 | 59.05,29.08 59.05,27.37 C36.2 | IC4.8 59.05,29.08 | JP2.1 95.76,37.34 93.54,35.12 C9.2 | C9.2 90.81,34.74 | C9.2 | 90.04,34.84 C9.2 | U1.2 90.04,34.86 C9.2 | C33.1 30.29,57.08 30.23,57.15
  Top 0.508: U6.3 21.82,56.74 22.23,57.15 28.19,57.15 30.23,57.15 42.04,57.15
  Bottom 0.254: v27.81,51.94 27.81,54.1 v28.19,54.48
  Bottom 0.305: 59.05,41.15 v59.05,29.72 v59.05,20.07
  Bottom 0.61: JP2.1 96.52,37.34
-15V  (via drill 0.35)  (3 unrouted)
  Top 0.305: IC4.4 60.71,32.89 60.33,32.51 v60.33,32.26 60.33,34.48 C34.1 | v60.33,20.07 60.83,19.56 IC1.11 63.75,19.56 64.52,20.32 65.47,20.32 C35.1 | v74.17,14.73 73.73,14.29 R26.1 72.64,11.56 R13.1 | v75.31,23.88 R27.2
  Bottom 0.305: 60.33,25.91 v60.33,32.26 | 60.33,25.91 v60.33,20.07 | JP2.3 95.25,32.26 | v74.17,14.73 74.17,23.11 74.93,23.88 v75.31,23.88 75.31,24.26 74.93,24.64 61.59,24.64 60.33,25.91
DCLK  (1 unrouted)
DCS  (1 unrouted)
DDATA  (1 unrouted)
DGND  (3 unrouted)
  Top 0.305: 38.68,52.4 38.61,52.32 | USB.GND 89.59,48.59 86.36,51.82 39.12,51.82
  pour Top (isolate 0.203, rank 6): 39.37,-7.62 39.37,66.04 -11.43,66.04 -11.43,-7.62
GND  (via drill 0.35)  (7 unrouted)
  other vias: 44.96,53.98 53.34,25.78 59.69,18.16 76.2,14.35 93.98,16.89 82.55,20.07 78.74,29.72 64.77,37.34 63.5,26.54 86.36,40.01 68.58,46.61 82.68,44.45 65.41,39.75 87.5,13.84
  pour Top (isolate 0.203, rank 6): 39.91,64 105,64 105,-3 39.91,-3
  pour Bottom: -3,66.27 106,66.27 106,-3 -3,-3
N$1  (2 unrouted)
  Top 0.305: 65.47,30.35 C1.2 65.53,30.35 | 65.53,30.35 65.53,32.32 | IC4.2 65.53,30.35
N$2
  Top 0.305: JP4.1 54.36,10.67 53.98,11.05 R11.2
N$3
  Top 0.305: R5.1 46.61,8 46.35,8.26 46.35,11.05 45.97,11.43 R12.2
N$4
  Top 0.305: IC4.1 63.75,29.08 64.58,28.26 C1.1 R3.1
N$5
  Top 0.305: R9.1 C4.1 55.18,21.53 55.75,22.1 IC1.2 58.67,22.1 59.05,22.48 59.05,24.64 58.61,25.09 R8.2
N$6  (1 unrouted)
  Top 0.305: JP7.2 72.52,27.43 71.88,28.07 71.88,29.59 71.37,30.1 70.42,30.1 | R3.2 68.07,30.16 | 68.07,30.16 C2.2 | R2.2 67.62,30.61 68.07,30.16
N$7  (1 unrouted)
  Top 0.305: C3.1 54.93,28.39 55.37,28.83 55.37,29.97 55.75,30.35 IC4.7 | C3.1 R6.2 | 54.3,26.98 53.98,27.3 C3.1
N$8
  Top 0.305: R14.2 47.37,24.64 47.75,24.26 47.75,20.45 48.01,20.19 48.9,20.19 49.66,19.43 49.66,17.65 50.29,17.02 50.86,17.02 R15.1
N$9
  Top 0.305: IC4.6 54.36,31.62 53.98,31.24 C3.2 R6.1 R7.2
N$10
  Top 0.305: 51.56,27.56 50.8,26.8 46.99,26.8 | R14.3 44.83,26.8 46.99,26.8 | R30.1 48.2,33.47 46.99,32.26 46.99,26.8
N$11  (via drill 0.35)
  Top 0.305: v67.94,12.57 R16.2 | IC1.14 63.88,23.37 64.14,23.62 64.14,24.51 64.39,24.77 65.47,24.77 C6.2 R20.2 69.66,24.83 69.85,24.64 v69.85,23.62
  Bottom 0.305: v69.85,23.62 69.85,13.21 69.22,12.57 v67.94,12.57
N$12
  Top 0.305: R18.1 70.23,11.56 R13.2
N$13
  Top 0.305: R18.2 R16.1 C5.2 64.33,16.19 63.5,17.02 IC1.9 61.21,17.02 60.58,16.38 60.58,14.99 60.96,14.61 61.09,14.61 61.47,14.22 61.47,8.51 61.09,8.13 53.72,8.13 | 53.72,8.13 51.56,10.29 R15.2 | R5.2 51.12,8.13 53.72,8.13
N$14
  Top 0.305: IC1.1 57.03,23.43 C4.2 R9.2 R10.1
N$15
  Top 0.305: C5.1 64.96,14.29 63.5,15.75 IC1.8 62.55,15.49 R28.1
N$16
  Top 0.305: IC1.12 63.88,20.83 64.01,20.95 64.01,21.46 64.14,21.59 67.56,21.59 67.94,21.21 R19.2 69.03,20.25 69.34,19.94 69.98,19.94 70.23,19.68 70.23,18.6 R23.1
N$17
  Top 0.305: R22.1 R21.2 R27.1
N$18
  Top 0.203: U5.6 8.12,30.73 7.37,29.97 5.97,29.97 | 5.97,29.97 C54.1 | L4.1 5.93,29.93 5.97,29.97
N$19
  Top 0.305: 70.1,21.53 R21.1 69.09,21.46 67.94,22.61 R20.1 C6.1 | 65.08,22.48 C6.1 | IC1.13 63.37,22.1 63.88,22.61 65.21,22.61 C6.1
N$20  (via drill 0.35)
  Top 0.305: IC1.7 58.67,15.75 59.05,15.37 59.05,11.3 JP4.2 | R12.3 48.51,13.97 49.15,13.34 49.15,11.3 49.78,10.67 v50.29,10.67
  Bottom 0.305: v50.29,10.67 52.58,10.67 55.12,13.21 57.91,13.21 58.42,12.7 JP4.2
N$21
  Top 0.305: 72.39,18.54 R23.2 | 72.39,18.54 R24.1 | R26.2 72.39,16.44 72.39,18.54
N$22
  Top 0.305: RS.2 82.55,21.84 82.3,21.59 76.52,21.59 R22.2 | D1.C 89.92,22.48
  pour Top (no thermals): 80.26,22.1 98.93,22.1 98.93,24.38 80.26,24.38
N$23
  Top 0.305: R24.2 82.3,18.54 82.55,18.29 RS.1
  pour Top (no thermals): 83.57,4.32 83.57,11.3 84.84,11.3 84.84,18.03 80.26,18.03 80.26,4.32
N$24
  Top 0.305: C10.2 R31.2 88.39,29.46 88.77,29.08 U1.6
N$25
  Top 0.305: D1.A D2.C
N$26
  Top 0.305: D3.A R28.2
N$27
  Top 0.305: T2.E 72.5,4.19 70.61,4.19 70.1,4.7 D3.C
N$28
  Top 0.254: T1.E 89.47,13.65 90.04,14.22 90.04,17.78 D2.A
  Top 0.305: T1.E 88.84,13.53
N$29
  Top 0.305: R29.1 86.87,14.86 87.56,15.55 T1.B
N$31  (via drill 0.35)
  Top 0.305: T2.C v76.71,4.95 | C8.1 87,12.57 87.38,12.19 v87.63,12.19 90.04,12.19 90.93,13.08 90.93,14.44 T1.C
  Bottom 0.305: v87.63,12.19 Q1.B 87.63,5.59 86.36,4.32 77.34,4.32 v76.71,4.95
N$34
  pour Top (no thermals): 84.07,4.32 85.98,4.32 85.98,9.4 92.71,9.4 94.36,11.05 98.93,11.05 98.93,13.21 94.23,13.21 91.82,10.79 84.07,10.79
N$35
  Top 0.305: IC1.6 55.5,17.02 54.8,16.32 R11.1 53.98,17.27 53.47,17.78 50.67,17.78 50.42,18.03 50.42,19.81 49.15,21.08 R10.2
N$36  (1 unrouted)
N$46
  Top 0.203: TR1.3 31.98,44.03 R61.2 R60.1 31.68,47.95 31.5,48.13 30.35,48.13 29.2,49.29 IC10.4
N$49
  Top 0.305: PWR.A 37.5,53.31 R41.1
N$52
  Top 0.203: U5.1 6.84,33.23 6.68,33.07 | 6.68,33.07 Y1.P$2 | C55.2 6.6,33.15 6.68,33.07
N$59
  Top 0.203: U5.2 8.22,32.73 7.87,32.38 7.87,32 7.49,31.62 3.81,31.62 3.53,31.9 Y1.P$1 3.56,33.05 C56.2
N$61  (1 unrouted)
N$62  (1 unrouted)
N$63  (1 unrouted)
PA04_AIN4  (1 unrouted)
PA05_AIN5  (1 unrouted)
PA28_USB_HOST_EN  (1 unrouted)
PB10_S4_SPI_MOSI  (via drill 0.35)
  Top 0.203: U5.19 14.22,18.8 15.24,17.78 v16.26,17.78
  Bottom 0.203: v16.26,17.78 19.05,17.78 JP6.4
PB11_S4_SPI_SCK
  Top 0.203: U5.20 14.72,19.57 15.24,19.05 JP6.3
PB12_S4_SPI_MISO
  Top 0.203: JP6.1 15.75,21.59 15.22,22.12 U5.21
RESET  (3 unrouted)
  Bottom 0.203: JP6.5 15.37,16.51 14.99,16.89 14.99,18.67
RW  (via drill 0.35)  (2 unrouted)
  Top 0.305: JP7.1 76.2,27.18 | v62.23,34.8 62.23,35.94 61.72,36.45 57.66,36.45 57.15,35.94 57.15,32.96
  Bottom 0.305: v62.23,34.8 62.23,30.99 63.5,29.72 75.31,29.72 75.95,29.08 JP7.1
SCL  (3 unrouted)
SDA  (3 unrouted)
TARGET_RESET
  Top 0.203: U5.40 15.22,36.62 R56.2 C23.1
TARGET_USB_N
  Top 0.203: U5.33 37.1,31.73 38.3,32.94 38.3,49.99 38.61,50.29 85.56,50.29 89.67,46.19 USB.D-
TARGET_USB_P
  Top 0.203: U5.34 37.02,32.23 37.9,33.1 37.9,50.25 38.45,50.8 85.72,50.8 89.53,46.99 USB.D+
UGBIN  (1 unrouted)
  Top 0.305: R30.2 R44.2 R43.1
UGBOUT
  Top 0.305: IC3.7 IC3.6
USB_ID  (1 unrouted)
  Top 0.203: IC10.2 IC10.1 30.59,51.5 R62.1 35.24,51.5 35.43,51.31 85.98,51.31 89.5,47.79 USB.ID
USBVCC
  Top 0.305: 34.48,41.84 C12.2 R59.2 | 34.48,41.84 34.42,41.91 | 34.48,41.84 34.59,41.74 F1.2 33.74,41.74 32.26,40.26 TR1.1
VDDCORE
  Top 0.203: U5.43 13.72,37.4 C53.1
VREG  (4 unrouted)
  Top 0.254: R1.2 67.69,34.67
  Top 0.305: 68.13,34.16 R1.2 | R31.1 R32.2
XUSB  (via drill 0.33)
  Top 0.305: USB.VBUS 89.61,45.39 85.22,49.78 41.4,49.78 v40.77,49.15 | v36.45,50.04 36.45,48.33 C11.1 36.38,45.79 36.45,45.72 36.37,45.64 F1.1
  Bottom 0.305: v40.77,49.15 37.34,49.15 v36.45,50.04
(copper drawn outside any net)
  shapes: Top area x1

### Text on the board
tNames: + | TEC | -
Document: 5V | GND | 3V3 | GND | ICSP | + | GND | SUPPLY | - | +/-15V | I2C Header | + | TEC / SUPPLY | - | PROP GAIN | Serial | Digital I/O | I EN | PRESET CURRENT | INT GAIN
tDocu: SCL | SDA | GND | 3V3 | NTC | A2 | A1 | A0 | RST | TX | RX | 5V | GND | D1 | D2 | D3 | D4 | D5 | D6 | Precision Temperature Controller | A. Impertro, Rev 1.0, 2017